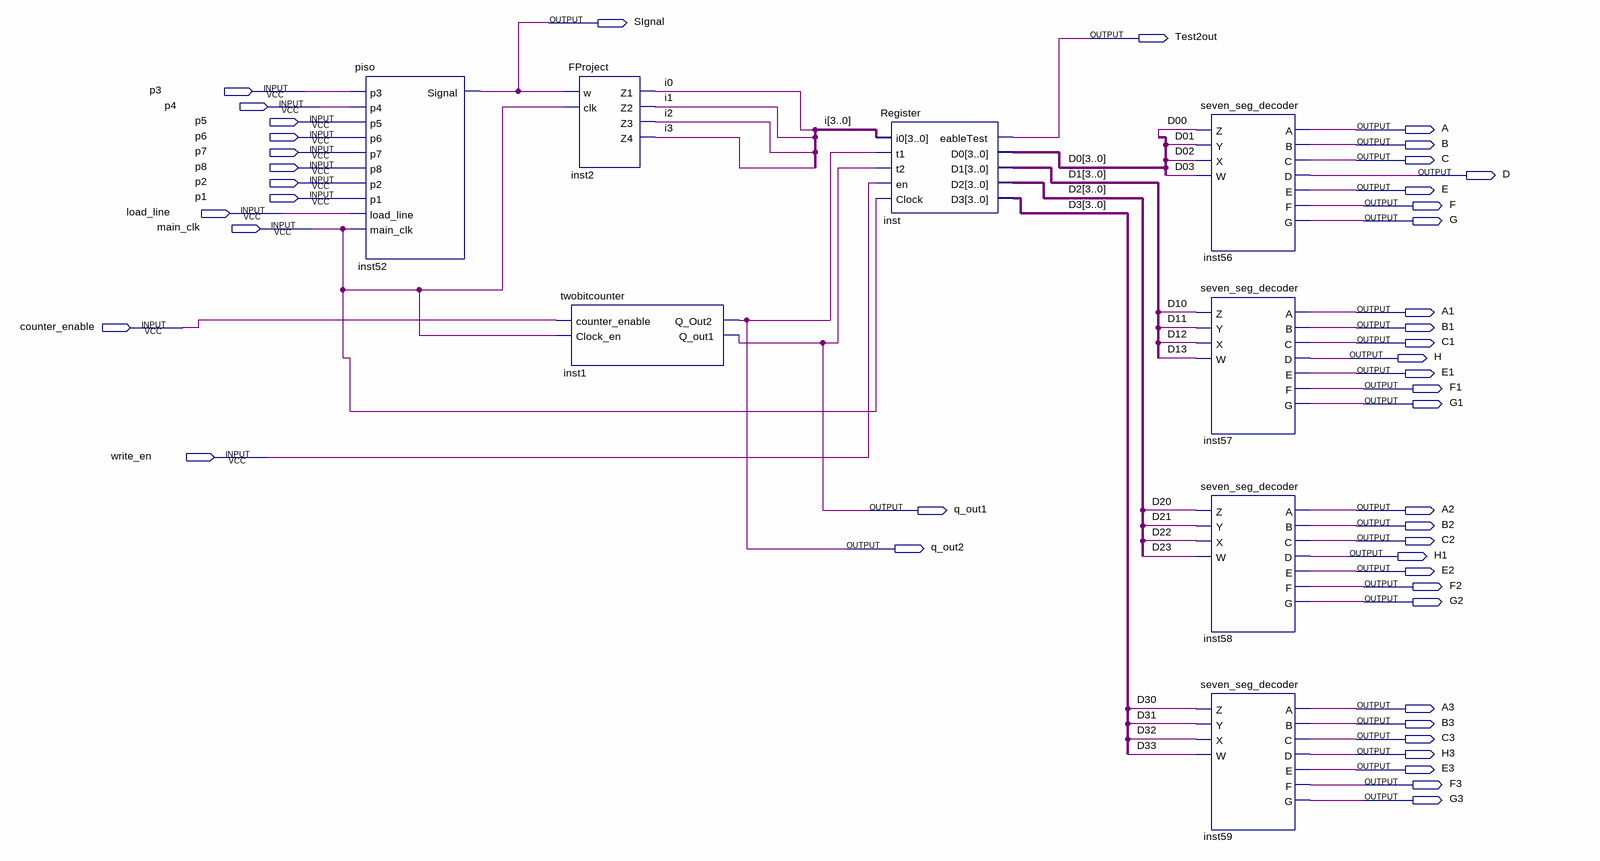
[diagram p0: schematic sheet]
// Quartus schematic FinalProject.bdf as structural Verilog: 8 symbols, 44 pins
module FinalProject (
  input  p3,
  input  p4,
  input  p5,
  input  p6,
  input  p7,
  input  p8,
  input  p2,
  input  p1,
  input  load_line,
  input  main_clk,
  input  counter_enable,
  input  write_en,
  output SIgnal,
  output Test2out,
  output A,
  output B,
  output C,
  output D,
  output E,
  output F,
  output G,
  output A1,
  output B1,
  output C1,
  output H,
  output E1,
  output F1,
  output G1,
  output q_out1,
  output A2,
  output B2,
  output C2,
  output q_out2,
  output H1,
  output E2,
  output F2,
  output G2,
  output A3,
  output B3,
  output C3,
  output H3,
  output E3,
  output F3,
  output G3
);

  wire [3:0] D0, D1, D2, D3, i;

  piso inst52 (
    .p3(p3), .p4(p4), .p5(p5), .p6(p6), .p7(p7), .p8(p8), .p2(p2), .p1(p1), .load_line(load_line),
    .main_clk(main_clk), .Signal(SIgnal));
  FProject inst2 (.w(SIgnal), .clk(main_clk), .Z1(i[0]), .Z2(i[1]), .Z3(i[2]), .Z4(i[3]));
  twobitcounter inst1 (.counter_enable(counter_enable), .Clock_en(main_clk), .Q_Out2(q_out2), .Q_out1(q_out1));
  Register inst (
    .i0(i), .t1(q_out2), .t2(q_out1), .en(write_en), .Clock(main_clk), .eableTest(Test2out), .D0(D0),
    .D1(D1), .D2(D2), .D3(D3));
  seven_seg_decoder inst56 (
    .Z(D0[0]), .Y(D0[1]), .X(D0[2]), .W(D0[3]), .A(A), .B(B), .C(C), .D(D), .E(E), .F(F), .G(G));
  seven_seg_decoder inst57 (
    .Z(D1[0]), .Y(D1[1]), .X(D1[2]), .W(D1[3]), .A(A1), .B(B1), .C(C1), .D(H), .E(E1), .F(F1), .G(G1));
  seven_seg_decoder inst58 (
    .Z(D2[0]), .Y(D2[1]), .X(D2[2]), .W(D2[3]), .A(A2), .B(B2), .C(C2), .D(H1), .E(E2), .F(F2), .G(G2));
  seven_seg_decoder inst59 (
    .Z(D3[0]), .Y(D3[1]), .X(D3[2]), .W(D3[3]), .A(A3), .B(B3), .C(C3), .D(H3), .E(E3), .F(F3), .G(G3));
endmodule
